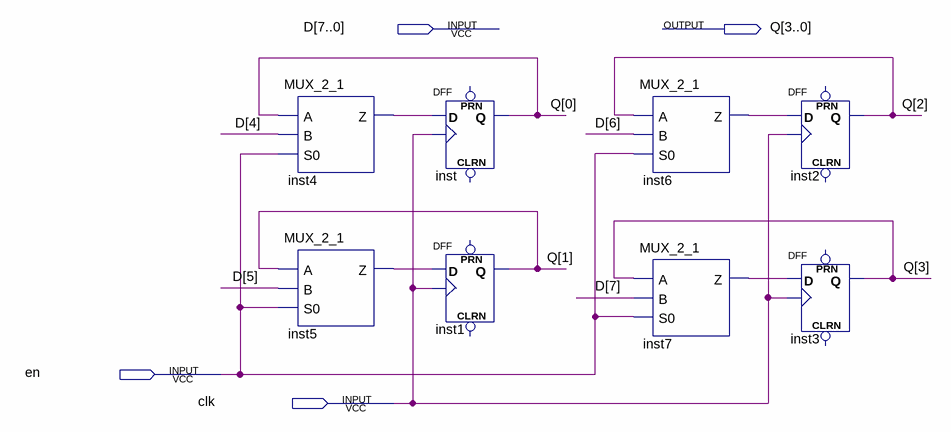
[diagram p0: schematic sheet]
// Quartus schematic RI.bdf as structural Verilog: 8 symbols, 4 pins
module RI (
  input  [7:0] D,
  input  en,
  input  clk,
  output [3:0] Q
);

  wire inst4_z, inst5_z, inst6_z, inst7_z;

  MUX_2_1 inst4 (.A(Q[0]), .B(D[4]), .S0(en), .Z(inst4_z));
  MUX_2_1 inst5 (.A(Q[1]), .B(D[5]), .S0(en), .Z(inst5_z));
  DFF inst (.CLK(clk), .D(inst4_z), .Q(Q[0]));  // open: CLRN, PRN
  DFF inst1 (.CLK(clk), .D(inst5_z), .Q(Q[1]));  // open: CLRN, PRN
  MUX_2_1 inst6 (.A(Q[2]), .B(D[6]), .S0(en), .Z(inst6_z));
  MUX_2_1 inst7 (.A(Q[3]), .B(D[7]), .S0(en), .Z(inst7_z));
  DFF inst2 (.CLK(clk), .D(inst6_z), .Q(Q[2]));  // open: CLRN, PRN
  DFF inst3 (.CLK(clk), .D(inst7_z), .Q(Q[3]));  // open: CLRN, PRN
endmodule
